# Altium project Milestone_1.PrjPcb
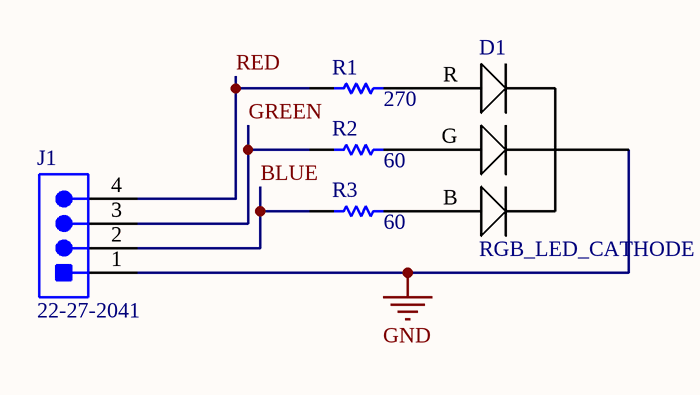
[diagram p0: Sheet1.SchDoc]
1 sheet, 5 parts. Net scope: global (net labels, ports and power ports of the same name join across sheets).
Board file: Top.PcbDoc

## Sheet Sheet1.SchDoc
size A

### Parts
D1  RGB_LED_CATHODE  [RGB_LED_Cathode]
J1  22-27-2041  [MOLX-22-27-2041_V]
R1  value 270  [RESC0805(2012)_L]  (hidden comment: 243K 1% 0805(2012))
R2  value 60  [RESC0603(1608)_N]  (hidden comment: 9M1 1% 0603(1608))
R3  value 60  [RESC0603(1608)_N]  (hidden comment: 9M1 1% 0603(1608))

### Nets
GND: D1.Common J1.1
BLUE: J1.2 R3.1
GREEN: J1.3 R2.1
RED: J1.4 R1.1
NetD1_B: D1.B R3.2
NetD1_G: D1.G R2.2
NetD1_R: D1.R R1.2

### Library data of the parts
J1 = CMP-2000-05243-1: Male Header, Pitch 2.54 mm, 1 x 4 Position, Height 11.7 mm, Tail Length 3.56 mm, RoHS, Bulk; Manufacturer: Molex; Voltage rating: 250V; Current rating: 4A; Datasheet Version: Rev. F, 06/2009; Operating temperature: 0degCto+75degC; Contact material: Tinplatedbrass; Manufacturer URL: http://www.molex.com/; Housing material: Nylon(UL94V-0); Datasheet URL: http://www.molex.com/pdm_docs/sd/022272041_sd.pdf
R1 = CMP-1013-00778-1: 243K 0.125W 1% 0805 (2012 Metric)  SMD; Case-Metric: 2012; Case-EIA: 0805; Power: 0.125 W; Technology: SMT; Tolerance: 1 %
R2 R3 = CMP-1012-00958-1: 9M1 0.1W 1% 0603 (1608 Metric)  SMD; Case-EIA: 0603; Case-Metric: 1608; Power: 0.1 W; Technology: SMT; Tolerance: 1 %